# Altium schematic sheet MCU-Debug.SchDoc: =ProjectTitle
size 297 x 209 mm; Address1: Address1; Address2: Address2; Address3: Address3; Address4: Address4; SheetNumber: 4; SheetTotal: 16; Scale: 1:1; DocumentType: Схема электрическая принципиальная
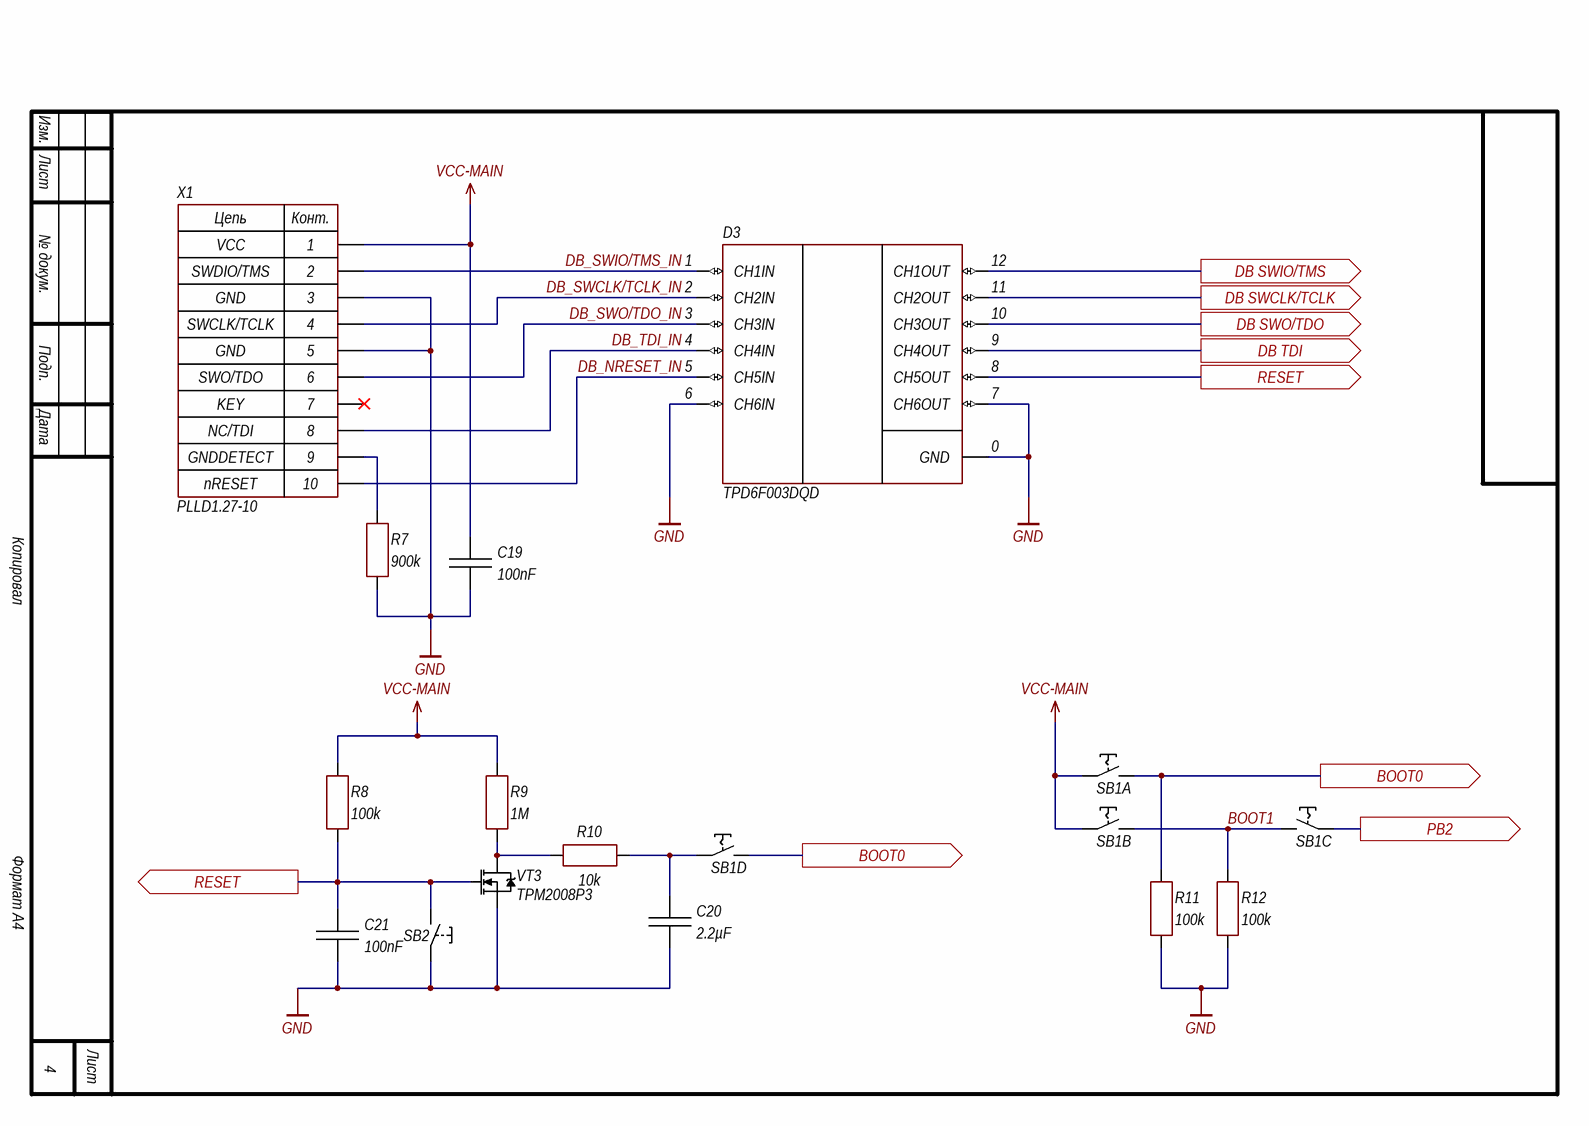
[diagram p0: MCU-Debug.SchDoc]

## Parts
C19  100nF  [CH0402C]
C20  2.2µF  [CH0402C]
C21  100nF  [CH0402C]
D3  TPD6F003DQD  [12-WSON (2.5x1.35 mm)]
R7  900k  [CH0402R]
R8  100k  [CH0402R]
R9  1M  [CH0402R]
R10  10k  [CH0402R]
R11  100k  [CH0402R]
R12  100k  [CH0402R]
SB1  *  [BUT: DSHP04TS]  (value not drawn)  (parts A,B,C,D of 4)
SB2  "Кнопка"  [BUT: YTS-A017]  (value not drawn)
VT3  TPM2008P3  [DFN1006-3L]
X1  PLLD1.27-10  [CON: PLLD-1.27-10]

## Ports
BOOT0 (out), DB SWCLK/TCLK (out), DB SWIO/TMS (out), DB SWO/TDO (out), DB TDI (out), PB2 (out), RESET (out)

## Nets
GND: C19.1 C20.1 C21.1 D3.0(GND) D3.6(CH6IN) D3.7(CH6OUT) R7.1 R11.1 R12.1 SB2.1 VT3.3(S) X1.3 X1.5
VCC-MAIN: C19.2 R8.2 R9.2 SB1.1 SB1.2 X1.1
BOOT0: R11.2 SB1.5 SB1.8 ; port BOOT0
BOOT1: R12.2 SB1.6 SB1.7
DB SWCLK/TCLK: D3.11(CH2OUT) ; port DB SWCLK/TCLK
DB SWIO/TMS: D3.12(CH1OUT) ; port DB SWIO/TMS
DB SWO/TDO: D3.10(CH3OUT) ; port DB SWO/TDO
DB TDI: D3.9(CH4OUT) ; port DB TDI
DB_NRESET_IN: D3.5(CH5IN) X1.10
DB_SWCLK/TCLK_IN: D3.2(CH2IN) X1.4
DB_SWIO/TMS_IN: D3.1(CH1IN) X1.2
DB_SWO/TDO_IN: D3.3(CH3IN) X1.6
DB_TDI_IN: D3.4(CH4IN) X1.8
PB2: SB1.3 ; port PB2
RESET: C21.2 D3.8(CH5OUT) R8.1 SB2.2 VT3.1(G) ; port RESET
NetC20_2: C20.2 R10.2 SB1.4
NetR7_2: R7.2 X1.9
NetR9_1: R9.1 R10.1 VT3.2(D)

Not connected (* = marked no-connect by the designer): X1 7*

## Notes on the sheet
- VCC
- SWDIO/TMS
- SWCLK/TCLK
- GND
- SWO/TDO
- KEY
- NC/TDI
- GNDDETECT
- nRESET
- Изм.
- Лист
- № докум.
- Подп.
- Дата
- Копировал
- Формат А4
- (in symbol 10-Connector) Цепь; Конт.

## Library data of the parts
C19-C21 = Capacitor: Manufacturer: *; Model: *; HelpURL: *; ComponentKind: *
  C19 C21: Value: 100nF
  C20: Value: 2.2µF
D3 = TPD6F003: 6-bit IO protection; Manufacturer: Texas Instruments; Model: TPD6F003DQD; ComponentKind: EMI Filter With Integrated ESD Protection; HelpURL: https://www.chipdip.ru/product0/8002872337
R7-R12 = Resistor: Manufacturer: *; Model: *; HelpURL: *; ComponentKind: *
  R7: Value: 900k
  R8 R11 R12: Value: 100k
  R9: Value: 1M
  R10: Value: 10k
SB1 = 4(1)-Switch: 4 Array, latching; Manufacturer: *; Model: *; HelpURL: *; ComponentKind: *
SB2 = 1-Button: Button, no latching; Manufacturer: *; Model: *; HelpURL: *; ComponentKind: *
VT3 = N-chanel: Mosfet; Manufacturer: TECH PUBLIC; Model: TPM2008P3; ComponentKind: 20V, 1.1V, 0.7A; HelpURL: https://www.lcsc.com/product-detail/MOSFETs_TECH-PUBLIC-TPM2008P3_C708974.html
X1 = 10-Connector: Model: PLLD1.27-10; Manufacturer: *; HelpURL: *; ComponentKind: *